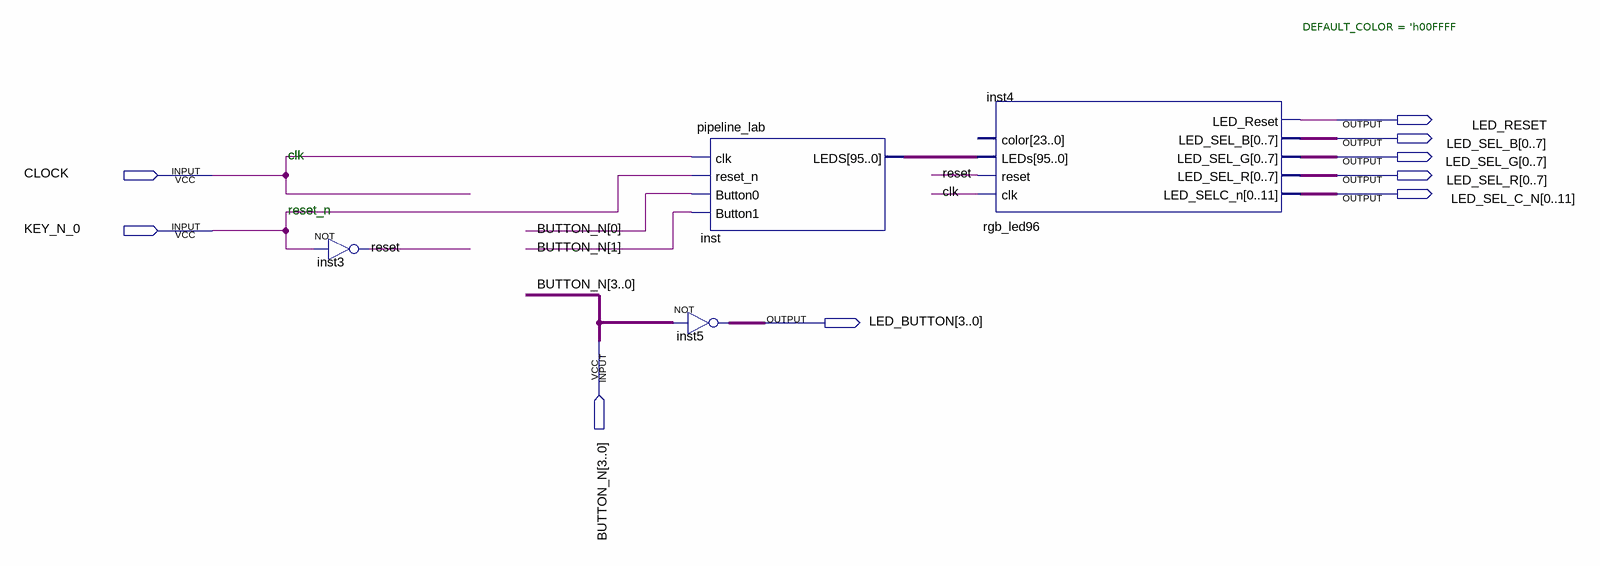
[diagram p0: schematic sheet]
// Quartus schematic FPGA4U_DE0.bdf as structural Verilog: 4 symbols, 9 pins
module FPGA4U_DE0 (
  input  CLOCK,
  input  KEY_N_0,
  input  [3:0] BUTTON_N,
  output LED_RESET,
  output [0:7] LED_SEL_B,
  output [0:7] LED_SEL_G,
  output [0:7] LED_SEL_R,
  output [0:11] LED_SEL_C_N,
  output [3:0] LED_BUTTON
);

  wire reset;
  wire [95:0] inst_leds;

  not inst3 (reset, KEY_N_0);
  pipeline_lab inst (.clk(CLOCK), .reset_n(KEY_N_0), .Button0(BUTTON_N[0]), .Button1(BUTTON_N[1]), .LEDS(inst_leds));
  assign LED_BUTTON = ~BUTTON_N;  // NOT inst5, 4 bits wide
  rgb_led96 #(.DEFAULT_COLOR('h00FFFF)) inst4 (
    .clk(CLOCK), .reset(reset), .LEDs(inst_leds), .LED_SELC_n(LED_SEL_C_N), .LED_SEL_R(LED_SEL_R),
    .LED_SEL_G(LED_SEL_G), .LED_SEL_B(LED_SEL_B), .LED_Reset(LED_RESET));  // open: color

  // Other names for the same wires on the sheet: clk = CLOCK; reset_n = KEY_N_0

  // Notes on the sheet:
  //   clk
  //   reset_n
endmodule
